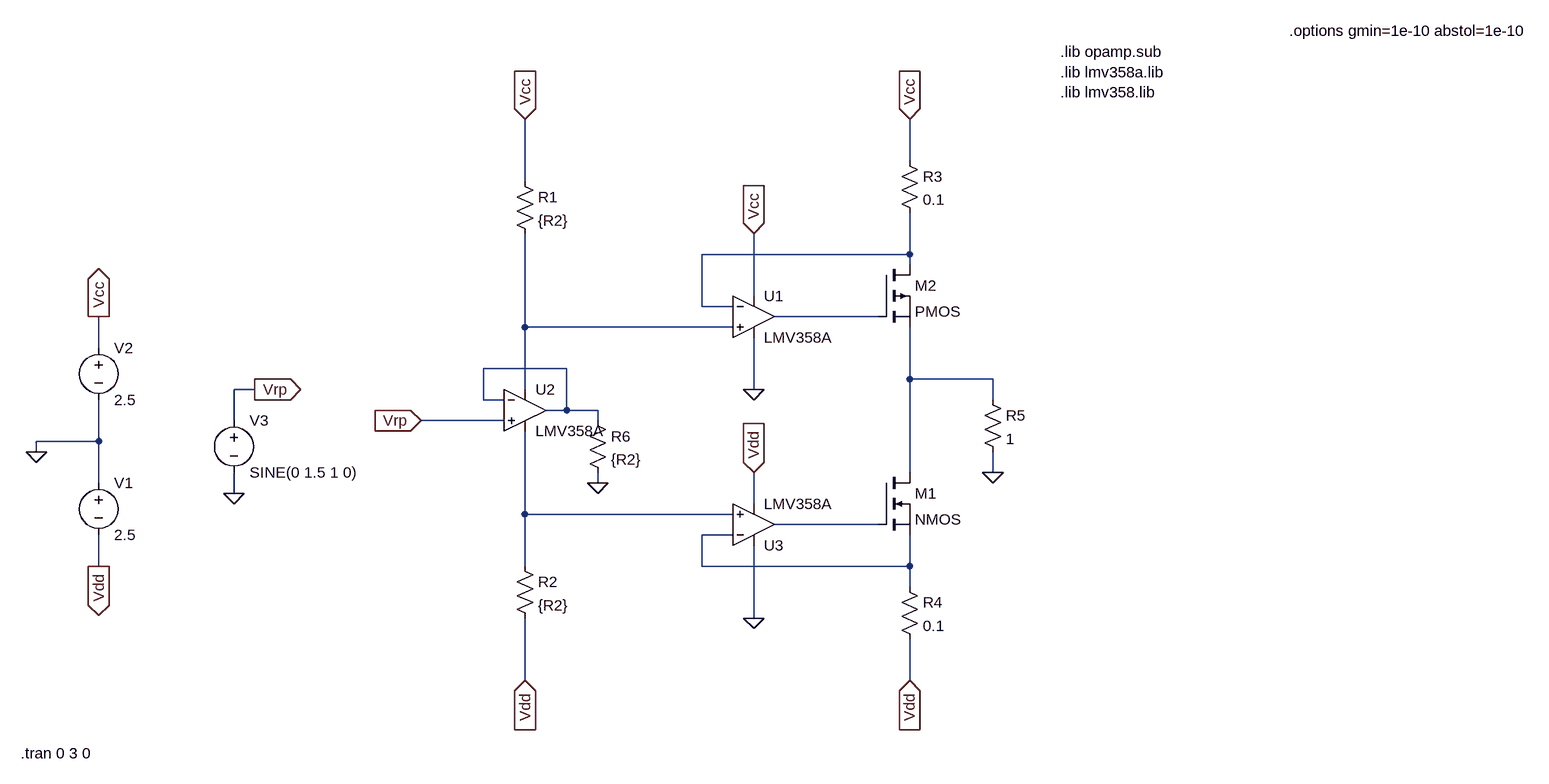
[diagram p0: schematic 230626-ideal_channel.asc]
230626-ideal_channel.asc, the LTspice schematic file:
Version 4
SHEET 1 1488 768
WIRE 496 -160 496 -224
WIRE -96 -128 -96 -224
WIRE 496 -16 496 -80
WIRE 496 -16 176 -16
WIRE 496 0 496 -16
WIRE 256 48 256 -48
WIRE 176 64 176 -16
WIRE 224 64 176 64
WIRE 448 80 288 80
WIRE -96 96 -96 -48
WIRE 224 96 -96 96
WIRE -752 128 -752 80
WIRE -32 160 -160 160
WIRE 496 176 496 96
WIRE 624 176 496 176
WIRE -512 192 -544 192
WIRE -96 192 -96 96
WIRE 256 192 256 112
WIRE -160 208 -160 160
WIRE -128 208 -160 208
WIRE 624 208 624 176
WIRE -32 224 -32 160
WIRE -32 224 -64 224
WIRE 16 224 -32 224
WIRE -544 240 -544 192
WIRE -128 240 -256 240
WIRE 16 240 16 224
WIRE -752 272 -752 208
WIRE -752 272 -848 272
WIRE -848 288 -848 272
WIRE 496 320 496 176
WIRE 624 320 624 288
WIRE -752 336 -752 272
WIRE 16 336 16 320
WIRE -544 352 -544 320
WIRE 256 368 256 320
WIRE -96 384 -96 256
WIRE 224 384 -96 384
WIRE 448 400 288 400
WIRE 224 416 176 416
WIRE -752 464 -752 416
WIRE -96 464 -96 384
WIRE 176 464 176 416
WIRE 496 464 496 416
WIRE 496 464 176 464
WIRE 496 496 496 464
WIRE 256 544 256 432
WIRE -96 640 -96 544
WIRE 496 640 496 576
FLAG 256 192 0
FLAG 256 544 0
FLAG 624 320 0
FLAG 16 336 0
FLAG -848 288 0
FLAG -752 80 Vcc
IOPIN -752 80 Out
FLAG -752 464 Vdd
IOPIN -752 464 Out
FLAG 496 -224 Vcc
IOPIN 496 -224 In
FLAG -96 -224 Vcc
IOPIN -96 -224 In
FLAG 256 -48 Vcc
IOPIN 256 -48 In
FLAG 256 320 Vdd
IOPIN 256 320 In
FLAG -96 640 Vdd
IOPIN -96 640 In
FLAG 496 640 Vdd
IOPIN 496 640 In
FLAG -544 352 0
FLAG -512 192 Vrp
IOPIN -512 192 Out
FLAG -256 240 Vrp
IOPIN -256 240 In
SYMBOL res -112 -144 R0
SYMATTR InstName R1
SYMATTR Value {R2}
SYMBOL res -112 448 R0
SYMATTR InstName R2
SYMATTR Value {R2}
SYMBOL res 480 -176 R0
SYMATTR InstName R3
SYMATTR Value 0.1
SYMBOL res 480 480 R0
SYMATTR InstName R4
SYMATTR Value 0.1
SYMBOL res 608 192 R0
SYMATTR InstName R5
SYMATTR Value 1
SYMBOL nmos 448 320 R0
SYMATTR InstName M1
SYMBOL pmos 448 0 R0
SYMATTR InstName M2
SYMBOL res 0 224 R0
SYMATTR InstName R6
SYMATTR Value {R2}
SYMBOL voltage -752 320 R0
WINDOW 123 0 0 Left 0
WINDOW 39 0 0 Left 0
SYMATTR InstName V1
SYMATTR Value 2.5
SYMBOL voltage -752 112 R0
WINDOW 123 0 0 Left 0
WINDOW 39 0 0 Left 0
SYMATTR InstName V2
SYMATTR Value 2.5
SYMBOL voltage -544 224 R0
WINDOW 123 0 0 Left 0
WINDOW 39 0 0 Left 0
SYMATTR InstName V3
SYMATTR Value SINE(0 1.5 1 0)
SYMBOL OpAmps\\opamp2 256 16 R0
SYMATTR InstName U1
SYMATTR Value LMV358A
SYMBOL OpAmps\\opamp2 -96 160 R0
SYMATTR InstName U2
SYMATTR Value LMV358A
SYMBOL OpAmps\\opamp2 256 464 M180
SYMATTR InstName U3
SYMATTR Value LMV358A
TEXT 728 -328 Left 2 !.lib opamp.sub\n.lib lmv358a.lib\n.lib lmv358.lib
TEXT -872 752 Left 2 !.tran 0 3 0
TEXT 1080 -360 Left 2 !.options gmin=1e-10 abstol=1e-10

The netlist it stands for:
* 230626-ideal_channel.asc
R1 Vcc N003 {R2}
R2 N006 Vdd {R2}
R3 Vcc N001 0.1
R4 N008 Vdd 0.1
R5 N005 0 1
M1 N005 N007 N008 N008 NMOS
M2 N001 N002 N005 N005 PMOS
R6 N004 0 {R2}
V1 0 Vdd 2.5
V2 Vcc 0 2.5
V3 Vrp 0 SINE(0 1.5 1 0)
XU1 N003 N001 Vcc 0 N002 LMV358A  ; pins In+ In- V+ V- OUT
XU2 Vrp N004 N003 N006 N004 LMV358A  ; pins In+ In- V+ V- OUT
XU3 N006 N008 0 Vdd N007 LMV358A  ; pins In+ In- V+ V- OUT
.model NMOS NMOS
.model PMOS PMOS
.lib standard.mos
.lib opamp.sub
.lib lmv358a.lib
.lib lmv358.lib
.tran 0 3 0
.options gmin=1e-10 abstol=1e-10
.backanno
.end